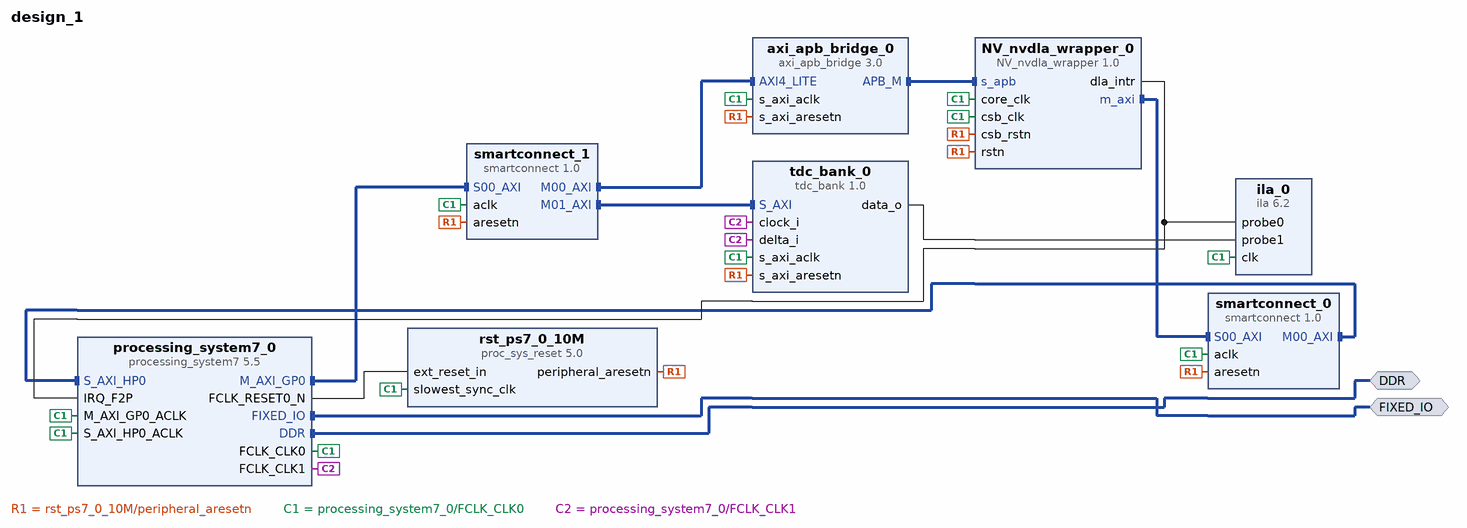
[diagram p0: block diagram of the top level]
# Vivado block design design_1, xc7z045ffg900-2, Vivado 2019.1
create_bd_design design_1

create_bd_intf_port -mode Master -vlnv xilinx.com:interface:ddrx_rtl:1.0 DDR
create_bd_intf_port -mode Master -vlnv xilinx.com:display_processing_system7:fixedio_rtl:1.0 FIXED_IO

create_bd_cell -type ip -vlnv xilinx.com:ip:processing_system7:5.5 processing_system7_0
set_property -dict [list \
  CONFIG.PCW_APU_PERIPHERAL_FREQMHZ 667.000000 \
  CONFIG.PCW_DUAL_PARALLEL_QSPI_DATA_MODE x8 \
  CONFIG.PCW_ENET0_ENET0_IO {MIO 16 .. 27} \
  CONFIG.PCW_ENET0_GRP_MDIO_ENABLE 1 \
  CONFIG.PCW_ENET0_GRP_MDIO_IO {MIO 52 .. 53} \
  CONFIG.PCW_ENET0_PERIPHERAL_ENABLE 1 \
  CONFIG.PCW_ENET0_PERIPHERAL_FREQMHZ {100 Mbps} \
  CONFIG.PCW_ENET0_RESET_ENABLE 1 \
  CONFIG.PCW_ENET0_RESET_IO {MIO 47} \
  CONFIG.PCW_ENET_RESET_ENABLE 1 \
  CONFIG.PCW_ENET_RESET_SELECT {Share reset pin} \
  CONFIG.PCW_EN_CLK1_PORT 1 \
  CONFIG.PCW_FCLK_CLK1_BUF TRUE \
  CONFIG.PCW_FPGA0_PERIPHERAL_FREQMHZ 10 \
  CONFIG.PCW_FPGA1_PERIPHERAL_FREQMHZ 150 \
  CONFIG.PCW_FPGA_FCLK1_ENABLE 1 \
  CONFIG.PCW_GPIO_MIO_GPIO_ENABLE 1 \
  CONFIG.PCW_GPIO_MIO_GPIO_IO MIO \
  CONFIG.PCW_I2C0_GRP_INT_ENABLE 0 \
  CONFIG.PCW_I2C0_I2C0_IO {MIO 50 .. 51} \
  CONFIG.PCW_I2C0_PERIPHERAL_ENABLE 1 \
  CONFIG.PCW_I2C0_RESET_ENABLE 1 \
  CONFIG.PCW_I2C0_RESET_IO {MIO 46} \
  CONFIG.PCW_I2C_PERIPHERAL_FREQMHZ 111.111115 \
  CONFIG.PCW_I2C_RESET_ENABLE 1 \
  CONFIG.PCW_I2C_RESET_SELECT {Share reset pin} \
  CONFIG.PCW_IRQ_F2P_INTR 1 \
  CONFIG.PCW_PRESET_BANK0_VOLTAGE {LVCMOS 1.8V} \
  CONFIG.PCW_PRESET_BANK1_VOLTAGE {LVCMOS 1.8V} \
  CONFIG.PCW_QSPI_GRP_FBCLK_ENABLE 1 \
  CONFIG.PCW_QSPI_GRP_FBCLK_IO {MIO 8} \
  CONFIG.PCW_QSPI_GRP_IO1_ENABLE 1 \
  CONFIG.PCW_QSPI_GRP_IO1_IO {MIO 0 9 .. 13} \
  CONFIG.PCW_QSPI_GRP_SINGLE_SS_ENABLE 0 \
  CONFIG.PCW_QSPI_INTERNAL_HIGHADDRESS 0xFDFFFFFF \
  CONFIG.PCW_QSPI_PERIPHERAL_ENABLE 1 \
  CONFIG.PCW_QSPI_QSPI_IO {MIO 1 .. 6} \
  CONFIG.PCW_SD0_GRP_CD_ENABLE 1 \
  CONFIG.PCW_SD0_GRP_CD_IO {MIO 14} \
  CONFIG.PCW_SD0_GRP_WP_ENABLE 1 \
  CONFIG.PCW_SD0_GRP_WP_IO {MIO 15} \
  CONFIG.PCW_SD0_PERIPHERAL_ENABLE 1 \
  CONFIG.PCW_SD0_SD0_IO {MIO 40 .. 45} \
  CONFIG.PCW_SDIO_PERIPHERAL_FREQMHZ 50 \
  CONFIG.PCW_UART1_PERIPHERAL_ENABLE 1 \
  CONFIG.PCW_UART1_UART1_IO {MIO 48 .. 49} \
  CONFIG.PCW_UART_PERIPHERAL_FREQMHZ 50 \
  CONFIG.PCW_UIPARAM_DDR_FREQ_MHZ 533.333313 \
  CONFIG.PCW_UIPARAM_DDR_PARTNO Custom \
  CONFIG.PCW_USB0_PERIPHERAL_ENABLE 0 \
  CONFIG.PCW_USB_RESET_ENABLE 1 \
  CONFIG.PCW_USE_FABRIC_INTERRUPT 1 \
  CONFIG.PCW_USE_S_AXI_HP0 1 \
  CONFIG.preset ZC706 \
] [get_bd_cells processing_system7_0]
# 235 more settings of processing_system7_0 are not shown: defaults, MIO pin electricals, DDR timing, and values the tool derives
create_bd_cell -type ip -vlnv xilinx.com:user:NV_nvdla_wrapper:1.0 NV_nvdla_wrapper_0
create_bd_cell -type ip -vlnv xilinx.com:ip:axi_apb_bridge:3.0 axi_apb_bridge_0
set_property -dict {CONFIG.C_APB_NUM_SLAVES 1} [get_bd_cells axi_apb_bridge_0]
create_bd_cell -type ip -vlnv xilinx.com:ip:smartconnect:1.0 smartconnect_0
set_property -dict {CONFIG.NUM_SI 1} [get_bd_cells smartconnect_0]
create_bd_cell -type ip -vlnv xilinx.com:ip:proc_sys_reset:5.0 rst_ps7_0_10M
create_bd_cell -type ip -vlnv xilinx.com:ip:smartconnect:1.0 smartconnect_1
set_property -dict {CONFIG.NUM_MI 3 CONFIG.NUM_SI 1} [get_bd_cells smartconnect_1]
create_bd_cell -type ip -vlnv xilinx.com:ip:ila:6.2 ila_0
set_property -dict [list \
  CONFIG.C_DATA_DEPTH 131072 \
  CONFIG.C_ENABLE_ILA_AXI_MON false \
  CONFIG.C_MONITOR_TYPE Native \
  CONFIG.C_NUM_OF_PROBES 2 \
  CONFIG.C_PROBE1_WIDTH 32 \
  CONFIG.C_PROBE2_WIDTH 1 \
  CONFIG.C_PROBE3_WIDTH 1 \
] [get_bd_cells ila_0]
create_bd_cell -type ip -vlnv emse.sas:sca:tdc_bank:1.0 tdc_bank_0
set_property -dict {CONFIG.count_g 8 CONFIG.depth_g 8 CONFIG.width_g 32} [get_bd_cells tdc_bank_0]

# ---- connections ----

connect_bd_intf_net [get_bd_intf_ports FIXED_IO] [get_bd_intf_pins processing_system7_0/FIXED_IO]
connect_bd_intf_net [get_bd_intf_pins axi_apb_bridge_0/AXI4_LITE] [get_bd_intf_pins smartconnect_1/M00_AXI]
connect_bd_intf_net [get_bd_intf_pins NV_nvdla_wrapper_0/m_axi] [get_bd_intf_pins smartconnect_0/S00_AXI]
connect_bd_intf_net [get_bd_intf_pins smartconnect_0/M00_AXI] [get_bd_intf_pins processing_system7_0/S_AXI_HP0]
connect_bd_intf_net [get_bd_intf_pins axi_apb_bridge_0/APB_M] [get_bd_intf_pins NV_nvdla_wrapper_0/s_apb]
connect_bd_intf_net [get_bd_intf_pins smartconnect_1/S00_AXI] [get_bd_intf_pins processing_system7_0/M_AXI_GP0]
connect_bd_intf_net [get_bd_intf_ports DDR] [get_bd_intf_pins processing_system7_0/DDR]
connect_bd_intf_net [get_bd_intf_pins smartconnect_1/M01_AXI] [get_bd_intf_pins tdc_bank_0/S_AXI]
connect_bd_net [get_bd_pins processing_system7_0/FCLK_RESET0_N] [get_bd_pins rst_ps7_0_10M/ext_reset_in]
connect_bd_net [get_bd_pins rst_ps7_0_10M/peripheral_aresetn] \
  [get_bd_pins axi_apb_bridge_0/s_axi_aresetn] [get_bd_pins NV_nvdla_wrapper_0/csb_rstn] \
  [get_bd_pins NV_nvdla_wrapper_0/rstn] [get_bd_pins smartconnect_0/aresetn] [get_bd_pins smartconnect_1/aresetn] \
  [get_bd_pins tdc_bank_0/s_axi_aresetn]
connect_bd_net [get_bd_pins NV_nvdla_wrapper_0/dla_intr] [get_bd_pins processing_system7_0/IRQ_F2P] [get_bd_pins ila_0/probe0]
connect_bd_net [get_bd_pins processing_system7_0/FCLK_CLK0] \
  [get_bd_pins processing_system7_0/S_AXI_HP0_ACLK] [get_bd_pins processing_system7_0/M_AXI_GP0_ACLK] \
  [get_bd_pins smartconnect_0/aclk] [get_bd_pins rst_ps7_0_10M/slowest_sync_clk] [get_bd_pins NV_nvdla_wrapper_0/core_clk] \
  [get_bd_pins NV_nvdla_wrapper_0/csb_clk] [get_bd_pins axi_apb_bridge_0/s_axi_aclk] [get_bd_pins smartconnect_1/aclk] \
  [get_bd_pins ila_0/clk] [get_bd_pins tdc_bank_0/s_axi_aclk]
connect_bd_net [get_bd_pins processing_system7_0/FCLK_CLK1] [get_bd_pins tdc_bank_0/clock_i] [get_bd_pins tdc_bank_0/delta_i]
connect_bd_net [get_bd_pins tdc_bank_0/data_o] [get_bd_pins ila_0/probe1]

# ---- address map ----
assign_bd_address -offset 0x0000000000000000 -range 1G -target_address_space [get_bd_addr_spaces NV_nvdla_wrapper_0/m_axi] [get_bd_addr_segs processing_system7_0/S_AXI_HP0/HP0_DDR_LOWOCM]
assign_bd_address -offset 0x40000000 -range 64K -target_address_space [get_bd_addr_spaces processing_system7_0/Data] [get_bd_addr_segs NV_nvdla_wrapper_0/s_apb/reg]
assign_bd_address -offset 0x43C00000 -range 64K -target_address_space [get_bd_addr_spaces processing_system7_0/Data] [get_bd_addr_segs tdc_bank_0/S_AXI/S_AXI_reg]

validate_bd_design
save_bd_design
